# Altium schematic sheet UART_TO_RS232.SchDoc
size A4; Author: Wojciech Grędel; Revision: 1
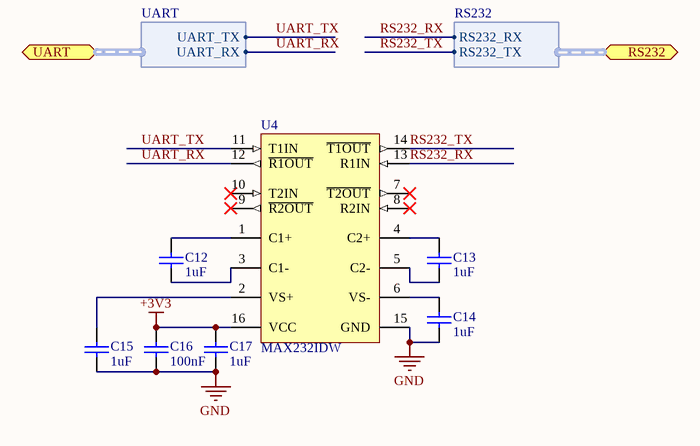
[diagram p0: UART_TO_RS232.SchDoc]

## Parts
C12  value 1uF  [CAP_0805_IPC_MD]  (hidden comment: Cap)
C13  value 1uF  [CAP_0805_IPC_MD]  (hidden comment: Cap)
C14  value 1uF  [CAP_0805_IPC_MD]  (hidden comment: Cap)
C15  value 1uF  [CAP_0805_IPC_MD]  (hidden comment: Cap)
C16  value 100nF  [CAP_0805_IPC_MD]  (hidden comment: Cap)
C17  value 1uF  [CAP_0805_IPC_MD]  (hidden comment: Cap)
U4  MAX232IDW  [SO_16_IPC_MD]

## Ports
RS232 (harness RS232), UART (harness UART)

## Harnesses
UART: UART_TX, UART_RX
RS232: RS232_RX, RS232_TX

## Nets
+3V3: C16.2 C17.2 U4.16(VCC)
GND: C14.1 C15.1 C16.1 C17.1 U4.15(GND)
RS232_RX: U4.13(R1IN) ; port RS232.RS232_RX
RS232_TX: U4.14(~{T1OUT}) ; port RS232.RS232_TX
UART_RX: U4.12(~{R1OUT}) ; port UART.UART_RX
UART_TX: U4.11(T1IN) ; port UART.UART_TX
NetC12_1: C12.1 U4.3(C1-)
NetC12_2: C12.2 U4.1(C1+)
NetC13_1: C13.1 U4.5(C2-)
NetC13_2: C13.2 U4.4(C2+)
NetC14_2: C14.2 U4.6(VS-)
NetC15_2: C15.2 U4.2(VS+)

Not connected (* = marked no-connect by the designer): U4 7(~{T2OUT})* 8(R2IN)* 9(~{R2OUT})* 10(T2IN)*

## Notes on the sheet
- Confidential / Not for distribution !
- Project name:
- Document name:
- Designer Name:
- Date/Time:
- Revision:

## Library data of the parts
C12-C17 = Cap: Capacitor; Manufacturer: Samsung; Supplier: TME
  C12-C15 C17: Supplier Part Number: CL21B105KOFNNNF
  C16: Supplier Part Number: CL21B104KBCNNNC
U4 = MAX232IDW: Dual EIA-232 Driver / Receiver, -40 to 85 degC, 16-Pin SOIC (DW), Green (RoHS & no Sb/Br); Manufacturer: Texas Instruments; SubFamily: RS-232; Drivers Per Package: 2; Supply Voltage(s)(V): 5; ESD HBM(kV): +/-2; ICC(Max)(mA): 10; Single Supply: TRUE; DatasheetVersion: SLLS047L; PackageVersion: revG, Jan-2011; PackageReference: DW16; PackageDescription: 16-Pin Small Outline Integrated Circuit, 10.3 x 7.5 mm, Pitch 1.27 mm Pitch; Receivers Per Package: 2; RS-232: TRUE; ComponentLink1Description: Manufacturer URL; ComponentLink1URL: www.ti.com; ComponentLink2Description: Datasheet; ComponentLink2URL: http://www.ti.com/general/docs/lit/getliterature.tsp?genericPartNumber=MAX232&fileType=pdf; ComponentLink3Description: Package Specification; ComponentLink3URL: http://www.ti.com/litv/pdf/msoi003g; Supplier: TME; Supplier Part Number: MAX232IDW